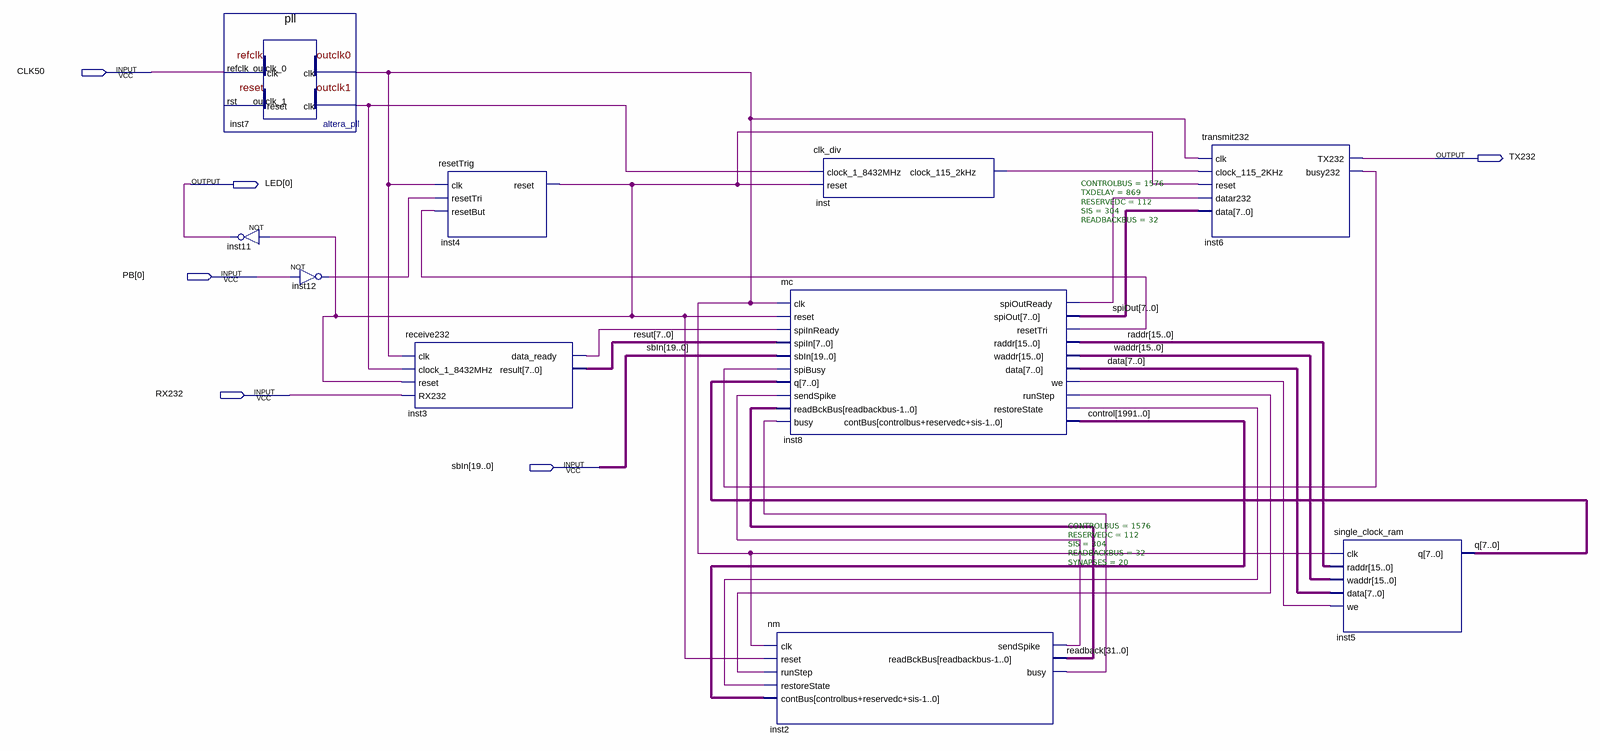
[diagram p0: schematic sheet]
// Quartus schematic HNN.bdf as structural Verilog: 10 symbols, 6 pins
module HNN (
  input  CLK50,
  input  [0:0] PB,
  input  RX232,
  input  [19:0] sbIn,
  output TX232,
  output [0:0] LED
);

  wire inst2_busy, inst2_sendspike, inst3_data_ready, inst4_reset, inst6_busy232, inst7_outclk_0,
       inst7_outclk_1, inst8_resettri, inst8_restorestate, inst8_runstep, inst8_spioutready, inst8_we,
       inst12_out, inst_clock_115_2khz;
  wire [7:0] data, q, resut, spiOut;
  wire [15:0] raddr, waddr;
  wire [31:0] readback;
  wire [1991:0] control;

  pll inst7 (.refclk(CLK50), .outclk_0(inst7_outclk_0), .outclk_1(inst7_outclk_1));  // open: rst
  not inst11 (LED[0], inst4_reset);
  not inst12 (inst12_out, PB[0]);
  receive232 inst3 (
    .clk(inst7_outclk_0), .clock_1_8432MHz(inst7_outclk_1), .reset(inst4_reset), .RX232(RX232),
    .data_ready(inst3_data_ready), .result(resut));
  resetTrig inst4 (.clk(inst7_outclk_0), .resetTri(inst12_out), .resetBut(inst8_resettri), .reset(inst4_reset));
  mc #(.CONTROLBUS(1576), .TXDELAY(869), .RESERVEDC(112), .SIS(304), .READBACKBUS(32)) inst8 (
    .clk(inst7_outclk_0), .reset(inst4_reset), .spiInReady(inst3_data_ready), .spiIn(resut), .sbIn(sbIn),
    .spiBusy(inst6_busy232), .q(q), .sendSpike(inst2_sendspike), .readBckBus(readback), .busy(inst2_busy),
    .spiOutReady(inst8_spioutready), .spiOut(spiOut), .resetTri(inst8_resettri), .raddr(raddr),
    .waddr(waddr), .data(data), .we(inst8_we), .runStep(inst8_runstep), .restoreState(inst8_restorestate),
    .contBus(control));
  nm #(.CONTROLBUS(1576), .RESERVEDC(112), .SIS(304), .READBACKBUS(32), .SYNAPSES(20)) inst2 (
    .clk(inst7_outclk_0), .reset(inst4_reset), .runStep(inst8_runstep), .restoreState(inst8_restorestate),
    .contBus(control), .sendSpike(inst2_sendspike), .readBckBus(readback), .busy(inst2_busy));
  clk_div inst (.clock_1_8432MHz(inst7_outclk_1), .reset(inst4_reset), .clock_115_2kHz(inst_clock_115_2khz));
  transmit232 inst6 (
    .clk(inst7_outclk_0), .clock_115_2KHz(inst_clock_115_2khz), .reset(inst4_reset),
    .datar232(inst8_spioutready), .data(spiOut), .TX232(TX232), .busy232(inst6_busy232));
  single_clock_ram inst5 (.clk(inst7_outclk_0), .raddr(raddr), .waddr(waddr), .data(data), .we(inst8_we), .q(q));
endmodule
